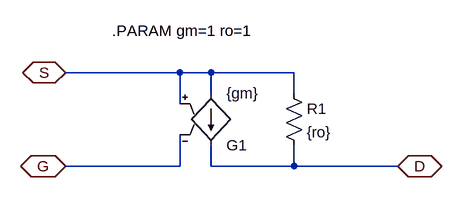
[diagram p0: schematic pmos_small_signal.asc]
pmos_small_signal.asc, the LTspice schematic file:
Version 4
SHEET 1 880 680
WIRE 208 64 32 64
WIRE 256 64 208 64
WIRE 384 64 256 64
WIRE 256 96 256 64
WIRE 384 96 384 64
WIRE 208 112 208 64
WIRE 208 208 208 160
WIRE 208 208 32 208
WIRE 256 208 256 176
WIRE 384 208 384 176
WIRE 384 208 256 208
WIRE 544 208 384 208
FLAG 32 64 S
IOPIN 32 64 BiDir
FLAG 32 208 G
IOPIN 32 208 BiDir
FLAG 544 208 D
IOPIN 544 208 BiDir
SYMBOL g2 256 192 M180
SYMATTR InstName G1
SYMATTR Value {gm}
SYMBOL res 368 80 R0
SYMATTR InstName R1
SYMATTR Value {ro}
TEXT 104 0 Left 2 !.PARAM gm=1 ro=1

The netlist it stands for:
* pmos_small_signal.asc
G1 S D S G {gm}
R1 S D {ro}
.PARAM gm=1 ro=1
.backanno
.end